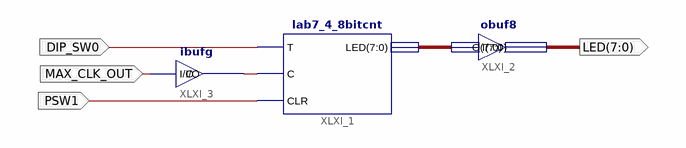
[diagram p0: schematic sheet 1]
// Xilinx ISE schematic lab7_5_bus.sch (spartan3) as structural Verilog: 3 symbols, 4 ports
module lab7_5_bus (
  input  DIP_SW0,
  input  MAX_CLK_OUT,
  input  PSW1,
  output [7:0] LED
);

  wire [7:0] XLXN_1;

  lab7_4_8bitcnt XLXI_1 (.C(MAX_CLK_OUT), .CLR(PSW1), .LED(XLXN_1), .T(DIP_SW0));
  obuf8 XLXI_2 (.I(XLXN_1), .O(LED));
  ibufg XLXI_3 (.I(MAX_CLK_OUT), .O(MAX_CLK_OUT));
endmodule
